# Altium schematic sheet VGA_6bits.SchDoc: 6-bits VGA DAC
size A4; Author: Eladio Delgado Mingorance; CompanyName: Mareldem; Organization: Mareldem Technologies; Revision: 0.1; SheetNumber: 1; SheetTotal: 1
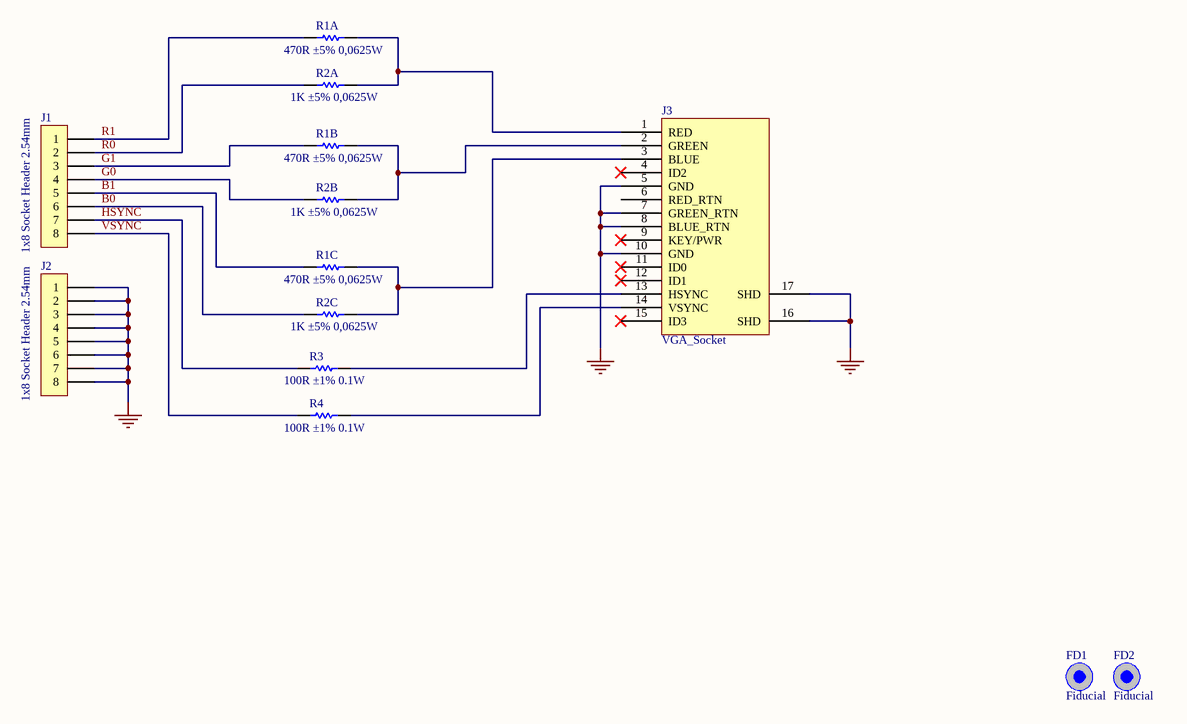
[diagram p0: VGA_6bits.SchDoc]

## Parts
FD1  Fiducial  [Fiducial_1mm]  (no BOM)
FD2  Fiducial  [Fiducial_1mm]  (no BOM)
J1  1x8 Socket Header 2.54mm  [1x8 Socket Header THT 2.54mm]
J2  1x8 Socket Header 2.54mm  [1x8 Socket Header THT 2.54mm]
J3  VGA_Socket  [VGA_RA_SLIM]
R1  value 470R ±5% 0,0625W  [4xArray_1206_Convex]  (parts A,B,C of 4)
R2  value 1K ±5% 0,0625W  [4xArray_1206_Convex]  (parts A,B,C of 4)
R3  value 100R ±1% 0.1W  [R0603]  (hidden comment: Resistor)
R4  value 100R ±1% 0.1W  [R0603]  (hidden comment: Resistor)

## Nets
GND: J2.1 J2.2 J2.3 J2.4 J2.5 J2.6 J2.7 J2.8 J3.5(GND) J3.7(GREEN_RTN) J3.8(BLUE_RTN) J3.10(GND) J3.16(SHD) J3.17(SHD)
B0: J1.6 R2.3
B1: J1.5 R1.3
G0: J1.4 R2.2
G1: J1.3 R1.2
HSYNC: J1.7 R3.1
R0: J1.2 R2.1
R1: J1.1 R1.1
VSYNC: J1.8 R4.1
NetJ3_1: J3.1(RED) R1.8 R2.8
NetJ3_2: J3.2(GREEN) R1.7 R2.7
NetJ3_3: J3.3(BLUE) R1.6 R2.6
NetJ3_13: J3.13(HSYNC) R3.2
NetJ3_14: J3.14(VSYNC) R4.2

Not connected (* = marked no-connect by the designer): J3 4(ID2)* 6(RED_RTN) 9(KEY/PWR)* 11(ID0)* 12(ID1)* 15(ID3)*

## Notes on the sheet
- Project
- Sheet
- Sheet         of
- Variant:
- Revision:
- A4
- Author:
- Date:
- Time:

## Library data of the parts
FD1 FD2 = Fiducial 1mm: Fiducial Mark; Part Number: Fiducial 1mm
J1 J2 = CON_SH_THT2.54_8: Connector, 8 pin Socket Header 2.54mm; Manufacturer: Samtec; OrderingCode: SSW-108-01-T-S; Temp_ Max: 125; Temp_ Min: -40; OrderingCode 2: 613 008 118 21; Value: 8; Pitch: 2.54mm; Part Number: CON_SH_THT2.54_8; Supplier: Samtec; Price (€): 0,438; Manufacturer 2: Würth Elektronik
J3 = VGA_RA_SLIM: OrderingCode: VGA Socket RA; Part Number: VGA_RA_SLIM
R1 = 4xArray_1206_Convex_470R_0,0625W_±5%: Resistor; Manufacturer: Yageo; Resistance: 470R; Tolerance: ±5%; OrderingCode: YC164-JR-07470RL; Temp_ Max: 155; Temp_ Min: -25; Part Number: 4xArray_1206_Convex_470R_0,0625W_±5%; Power: 0,0625W; Price (€): 0,006; PackageDescription: SMD
R2 = 4xArray_1206_Convex_1K_0,0625W_±5%: Resistor; Manufacturer: Yageo; Resistance: 1K; Tolerance: ±5%; OrderingCode: YC164-JR-071KL; Temp_ Max: 155; Temp_ Min: -25; Part Number: 4xArray_1206_Convex_1K_0,0625W_±5%; Power: 0,0625W; Price (€): 0,005; PackageDescription: SMD
R3 R4 = R0603_100R_0.1W_±1%: Resistor, SMD; Manufacturer: Vishay; Tolerance: ±1%; OrderingCode: CRCW0603100RFK; Power: 0.1W; Resistance: 100R; Temp_ Max: 155; Temp_ Min: -55; PackageDescription: SMD; Part Number: R0603_100R_0.1W_±1%; Price (€): 0,014